# Altium schematic sheet GCIT_1.0.SchDoc
size A3
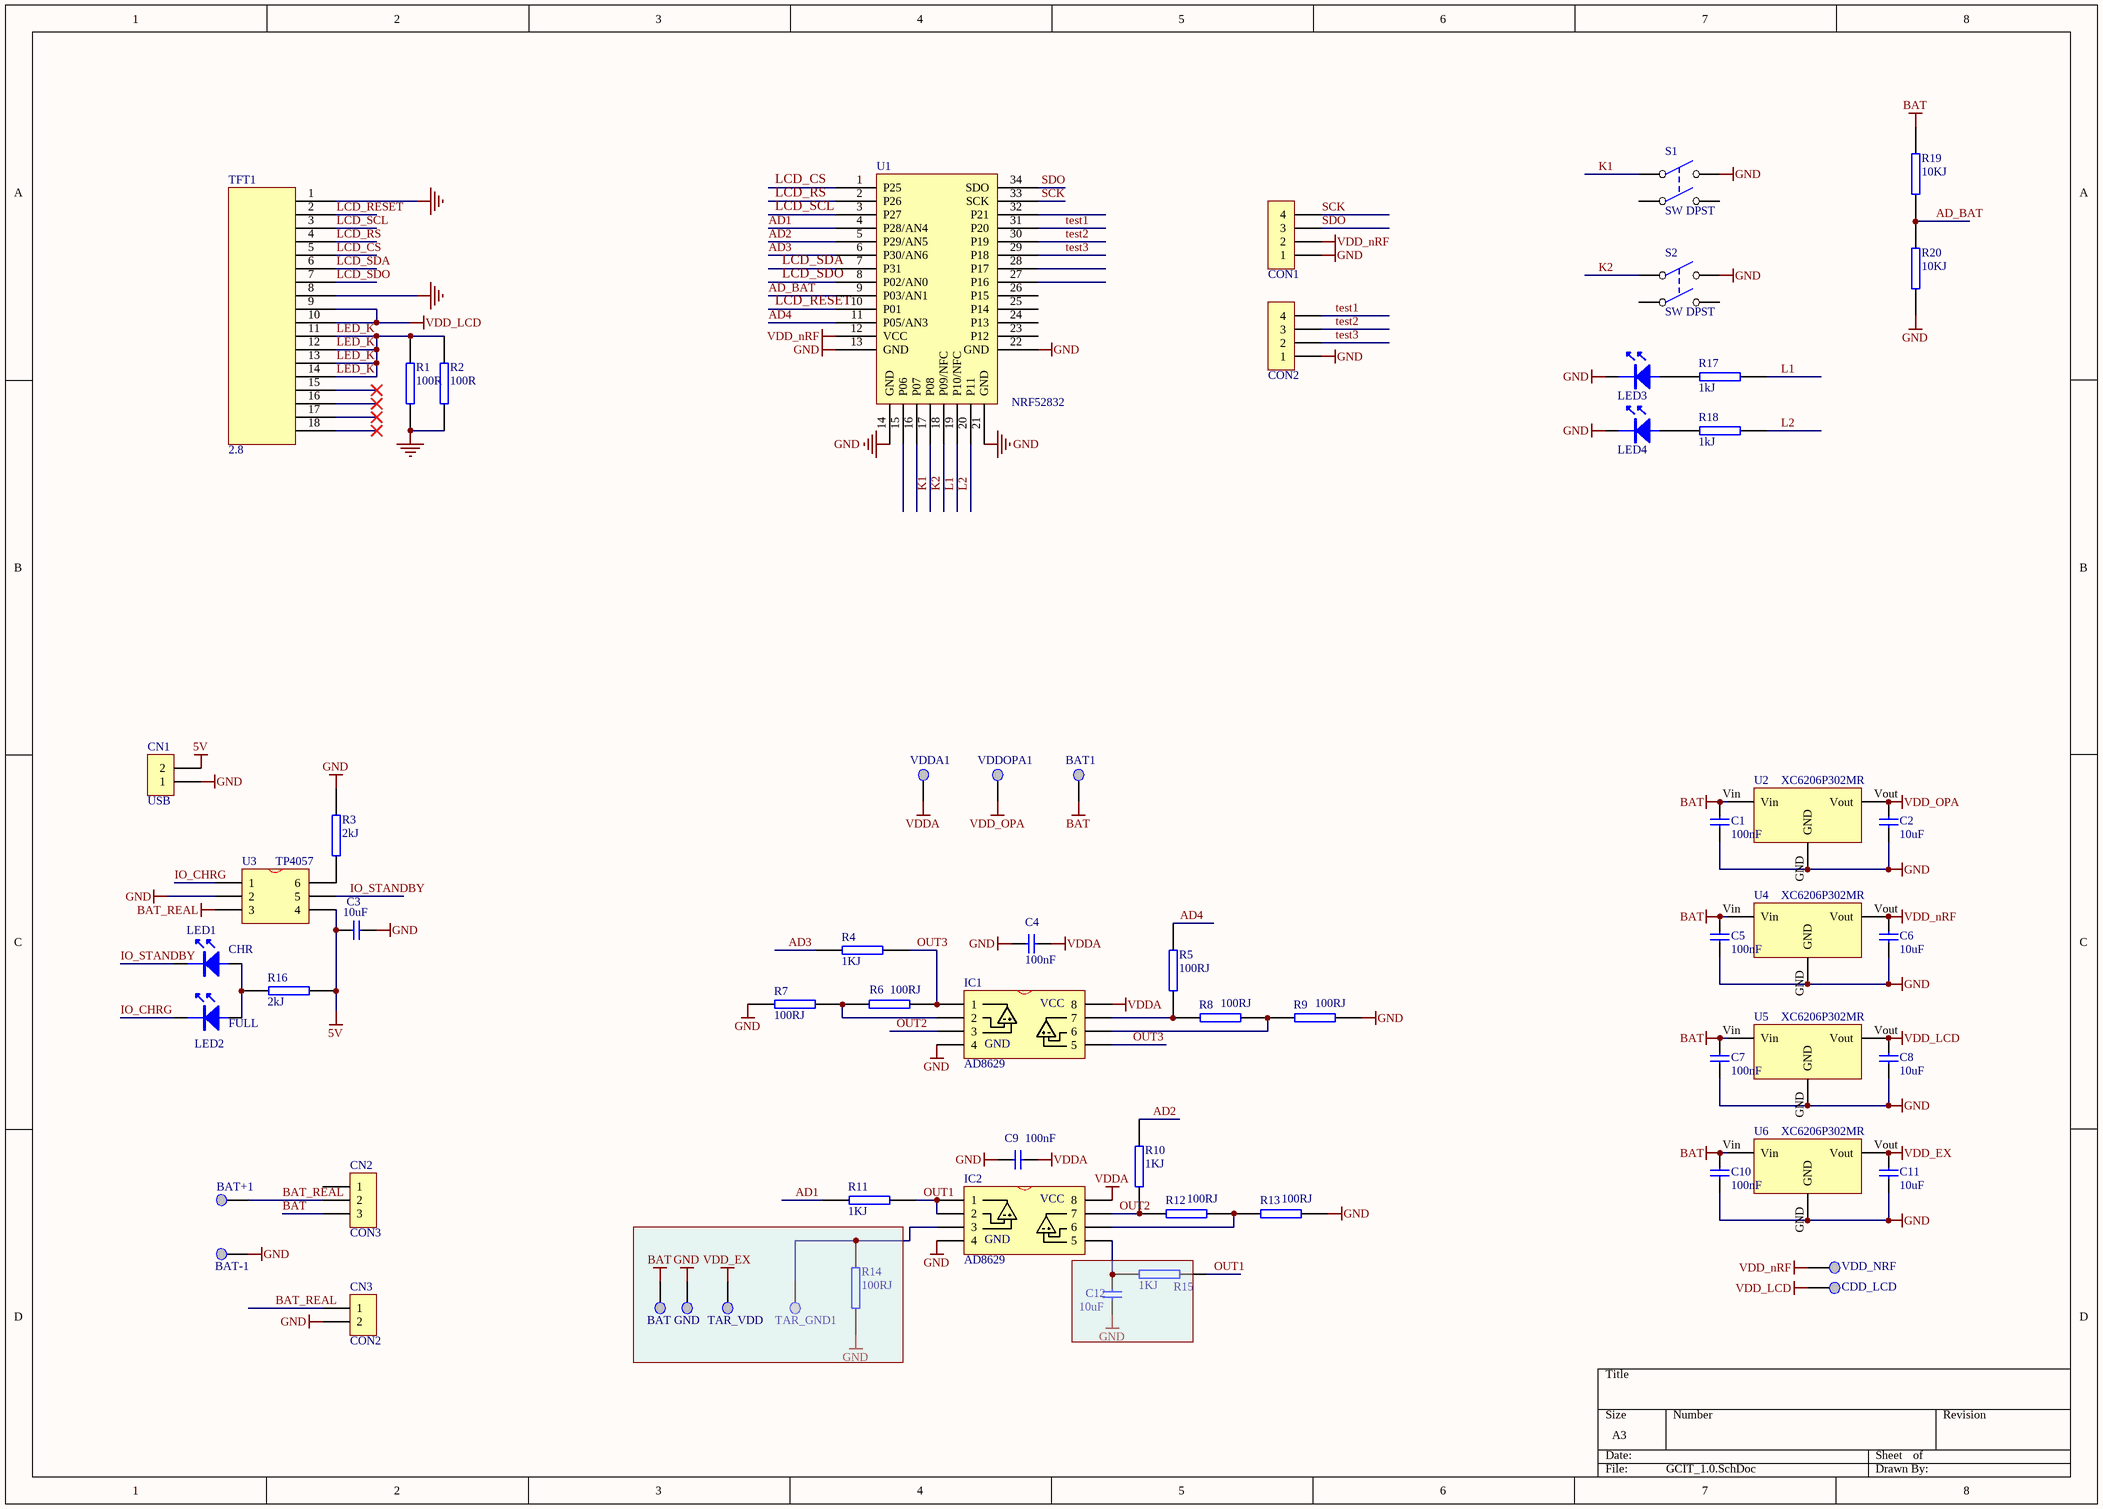
[diagram p0: GCIT_1.0.SchDoc]

## Parts
BAT  (no value)  [BAT_PAD]
BAT1  (no value)  [BAT_PAD]
BAT+1  (no value)  [BAT_PAD]
BAT-1  (no value)  [BAT_PAD]
C1  100nF  [0603C]
C2  10uF  [0603C]
C3  10uF  [0603C]
C4  100nF  [0603C]
C5  100nF  [0603C]
C6  10uF  [0603C]
C7  100nF  [0603C]
C8  10uF  [0603C]
C9  100nF  [0603C]
C10  100nF  [0603C]
C11  10uF  [0603C]
C12  10uF  [0603C]
CDD_LCD  (no value)  [BAT_PAD]
CN1  USB  [USB]
CN2  CON3  [MSK-12C01-07]
CN3  CON2  [SIP-2P]
CON1  CON4  [SIP-4P]  (value not drawn)
CON2  CON4  [SIP-4P]  (value not drawn)
GND  (no value)  [BAT_PAD]
IC1  AD8629  [SO-8]
IC2  AD8629  [SO-8]
LED1  CHR  [0603LED]
LED2  FULL  [0603LED]
LED3  CHR  [0603LED]  (value not drawn)
LED4  []  [0603LED]  (value not drawn)
R1  100R  [0603R]
R2  100R  [0603R]
R3  2kJ  [0603R]
R4  1KJ  [0603R]
R5  100RJ  [0603R]
R6  100RJ  [0603R]
R7  100RJ  [0603R]
R8  100RJ  [0603R]
R9  100RJ  [0603R]
R10  1KJ  [0603R]
R11  1KJ  [0603R]
R12  100RJ  [0603R]
R13  100RJ  [0603R]
R14  100RJ  [0603R]
R15  1KJ  [0603R]
R16  2kJ  [0603R]
R17  1kJ  [0603R]
R18  1kJ  [0603R]
R19  10KJ  [0603R]
R20  10KJ  [0603R]
S1  SW DPST  [key4x4]
S2  SW DPST  [key4x4]
TAR_GND1  (no value)  [DEBUG_PAD]
TAR_VDD  (no value)  [BAT_PAD]
TFT1  2.8  [TFT2.8-ZHA]
U1  NRF52832  [NRF52832_MODEL]
U2  XC6206P302MR  [SOT-23-S-LDO]
U3  TP4057  [SOT23-6-SMALL]
U4  XC6206P302MR  [SOT-23-S-LDO]
U5  XC6206P302MR  [SOT-23-S-LDO]
U6  XC6206P302MR  [SOT-23-S-LDO]
VDD_NRF  (no value)  [BAT_PAD]
VDDA1  (no value)  [BAT_PAD]
VDDOPA1  (no value)  [BAT_PAD]

## Nets
5V: C3.1 CN1.2 R16.1 U3.4
BAT: BAT.1 BAT1.1 C1.2 C5.2 C7.2 C10.2 CN2.3 R19.2 U2.Vin U4.Vin U5.Vin U6.Vin
BAT_REAL: BAT+1.1 CN2.2 CN3.1 U3.3
GND: BAT-1.1 C1.1 C2.1 C3.2 C4.1 C5.1 C6.1 C7.1 C8.1 C9.1 C10.1 C11.1 C12.1 CN1.1 CN3.2 CON1.1 CON2.1 GND.1 IC1.4 IC2.4 LED3.K LED4.K R1.1 R2.1 R3.2 R7.1 R9.1 R13.1 R14.2 R20.1 S1.2(NO1) S2.2(NO1) TFT1.1 TFT1.8 U1.13(GND) U1.14(GND) U1.21(GND) U1.22(GND) U2.GND U3.2 U4.GND U5.GND U6.GND
VDD_EX: C11.2 TAR_VDD.1 U6.Vout
VDD_LCD: C8.2 CDD_LCD.1 TFT1.9 TFT1.10 U5.Vout
VDD_nRF: C6.2 CON1.2 U1.12(VCC) U4.Vout VDD_NRF.1
VDD_OPA: C2.2 U2.Vout VDDOPA1.1
VDDA: C4.2 C9.2 IC1.8 IC2.8 VDDA1.1
AD1: R11.2 U1.4(P28/AN4)
AD2: R10.2 U1.5(P29/AN5)
AD3: R4.2 U1.6(P30/AN6)
AD4: R5.2 U1.11(P05/AN3)
AD_BAT: R19.1 R20.2 U1.9(P03/AN1)
IO_CHRG: LED2.K U3.1
IO_STANDBY: LED1.K U3.5
K1: S1.1(COMMON1) U1.17(P08)
K2: S2.1(COMMON1) U1.18(P09/NFC)
L1: R17.1 U1.19(P10/NFC)
L2: R18.1 U1.20(P11)
LCD_CS: TFT1.5 U1.1(P25)
LCD_RESET: TFT1.2 U1.10(P01)
LCD_RS: TFT1.4 U1.2(P26)
LCD_SCL: TFT1.3 U1.3(P27)
LCD_SDA: TFT1.6 U1.7(P31)
LCD_SDO: TFT1.7 U1.8(P02/AN0)
LED_K: R1.2 R2.2 TFT1.11 TFT1.12 TFT1.13 TFT1.14
OUT1: IC2.1 IC2.2 R11.1 R15.1
OUT2: IC1.3 IC2.7 R10.1 R12.2
OUT3: IC1.1 IC1.5 R4.1 R6.2
SCK: CON1.4 U1.33(SCK)
SDO: CON1.3 U1.34(SDO)
test1: CON2.4 U1.31(P20)
test2: CON2.3 U1.30(P19)
test3: CON2.2 U1.29(P18)
NetC12_2: C12.2 IC2.5 R15.2
NetIC1_2: IC1.2 R6.1 R7.2
NetIC1_6: IC1.6 R8.1 R9.2
NetIC1_7: IC1.7 R5.1 R8.2
NetIC2_3: IC2.3 R14.1 TAR_GND1.1
NetIC2_6: IC2.6 R12.1 R13.2
NetLED1_A: LED1.A LED2.A R16.2
NetLED3_A: LED3.A R17.2
NetLED4_A: LED4.A R18.2
NetR3_1: R3.1 U3.6

Not connected (* = marked no-connect by the designer): CN2 1; S1 3(COMMON2) 4(NO2); S2 3(COMMON2) 4(NO2); TFT1 15* 16* 17* 18*; U1 15(P06) 16(P07) 23(P12) 24(P13) 25(P14) 26(P15) 27(P16) 28(P17) 32(P21)

## Notes on the sheet
- (in symbol LM358) VCC; GND

## Library data of the parts
BAT BAT1 BAT+1 BAT-1 CDD_LCD GND TAR_GND1 TAR_VDD VDD_NRF VDDA1 VDDOPA1 = PAD
C1-C12 = C0402-47n: Capacitor, X7R, ?0%; Value: 47nF; Note: Chip Cap 10%; Artikkelnr Noca: 20039389; Artikkelnr Simpro: N.A.; Part Number: C0402-47n; Manufacturer: *; Manufacturer Part Number: *; Datasheet: *; LatestRevisionDate: 2009-05-08; Pin Count: 2; Publisher: Nordic Semiconductor; Published: 2009-05-08; Supplier: *; Supplier part number: *; 2nd source Supplier: *; 2nd source part number: *; Footprint Doc: 0402
CN1 CN3 = CON2: Connector
CN2 = CON3: Connector
CON1 CON2 = CON4: Connector
IC1 IC2 = LM358
LED1-LED4 = LED
R1-R20 = RES2
TFT1 = 18P
U2 U4-U6 = 7805
U3 = DIP6